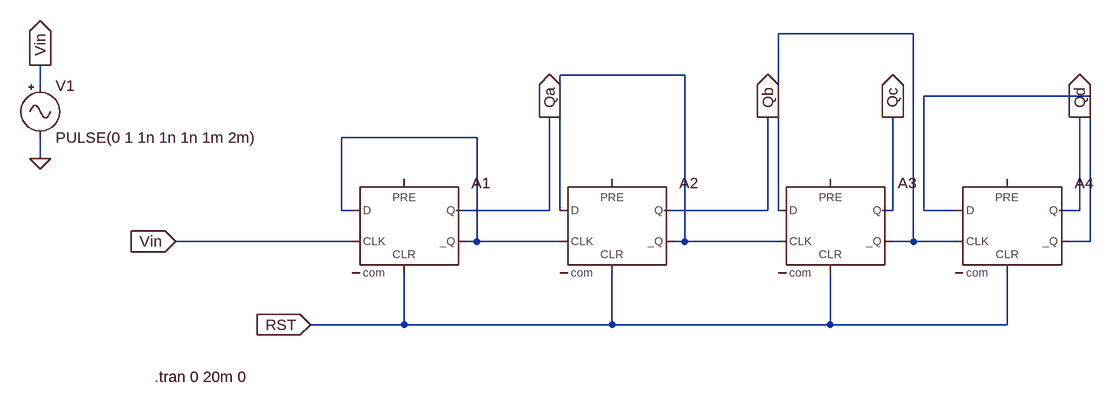
[diagram p0: schematic Frequency_counter.asc]
Frequency_counter.asc, the LTspice schematic file:
Version 4
SHEET 1 1212 680
WIRE 880 -144 672 -144
WIRE 528 -80 336 -80
WIRE -464 -64 -464 -96
WIRE 1152 -48 896 -48
WIRE 208 16 0 16
WIRE -464 48 -464 16
WIRE 0 128 0 16
WIRE 16 128 0 128
WIRE 320 128 320 -16
WIRE 320 128 176 128
WIRE 336 128 336 -80
WIRE 656 128 656 -16
WIRE 656 128 496 128
WIRE 672 128 672 -144
WIRE 848 128 848 -16
WIRE 848 128 832 128
WIRE 896 128 896 -48
WIRE 944 128 896 128
WIRE 1136 128 1136 -16
WIRE 1136 128 1104 128
WIRE 16 176 -256 176
WIRE 208 176 208 16
WIRE 208 176 192 176
WIRE 336 176 208 176
WIRE 528 176 528 -80
WIRE 528 176 512 176
WIRE 672 176 528 176
WIRE 880 176 880 -144
WIRE 880 176 848 176
WIRE 944 176 880 176
WIRE 1152 176 1152 -48
WIRE 1152 176 1120 176
WIRE 96 304 96 224
WIRE 96 304 -48 304
WIRE 416 304 416 224
WIRE 416 304 96 304
WIRE 752 304 752 224
WIRE 752 304 416 304
WIRE 1024 304 1024 224
WIRE 1024 304 752 304
FLAG 320 -16 Qa
IOPIN 320 -16 Out
FLAG 656 -16 Qb
IOPIN 656 -16 Out
FLAG 848 -16 Qc
IOPIN 848 -16 Out
FLAG -464 48 0
FLAG -48 304 RST
IOPIN -48 304 In
FLAG 1136 -16 Qd
IOPIN 1136 -16 Out
FLAG -464 -96 Vin
IOPIN -464 -96 Out
FLAG -256 176 Vin
IOPIN -256 176 In
SYMBOL Digital\\dflop 96 80 R0
SYMATTR InstName A1
SYMBOL Digital\\dflop 416 80 R0
SYMATTR InstName A2
SYMBOL Digital\\dflop 752 80 R0
SYMATTR InstName A3
SYMBOL Misc\\signal -464 -80 R0
WINDOW 123 0 0 Left 0
WINDOW 39 0 0 Left 0
SYMATTR InstName V1
SYMATTR Value PULSE(0 1 1n 1n 1n 1m 2m)
SYMBOL Digital\\dflop 1024 80 R0
SYMATTR InstName A4
TEXT -288 384 Left 2 !.tran 0 20m 0

The netlist it stands for:
* Frequency_counter.asc
A1 N004 0 Vin 0 RST N004 Qa 0 DFLOP
A2 N002 0 N004 0 RST N002 Qb 0 DFLOP
A3 N001 0 N002 0 RST N001 Qc 0 DFLOP
V1 Vin 0 PULSE(0 1 1n 1n 1n 1m 2m)
A4 N003 0 N001 0 RST N003 Qd 0 DFLOP
.tran 0 20m 0
.backanno
.end